# Altium schematic sheet display.SchDoc: Display
size A3; SheetNumber: 5; SheetTotal: 7
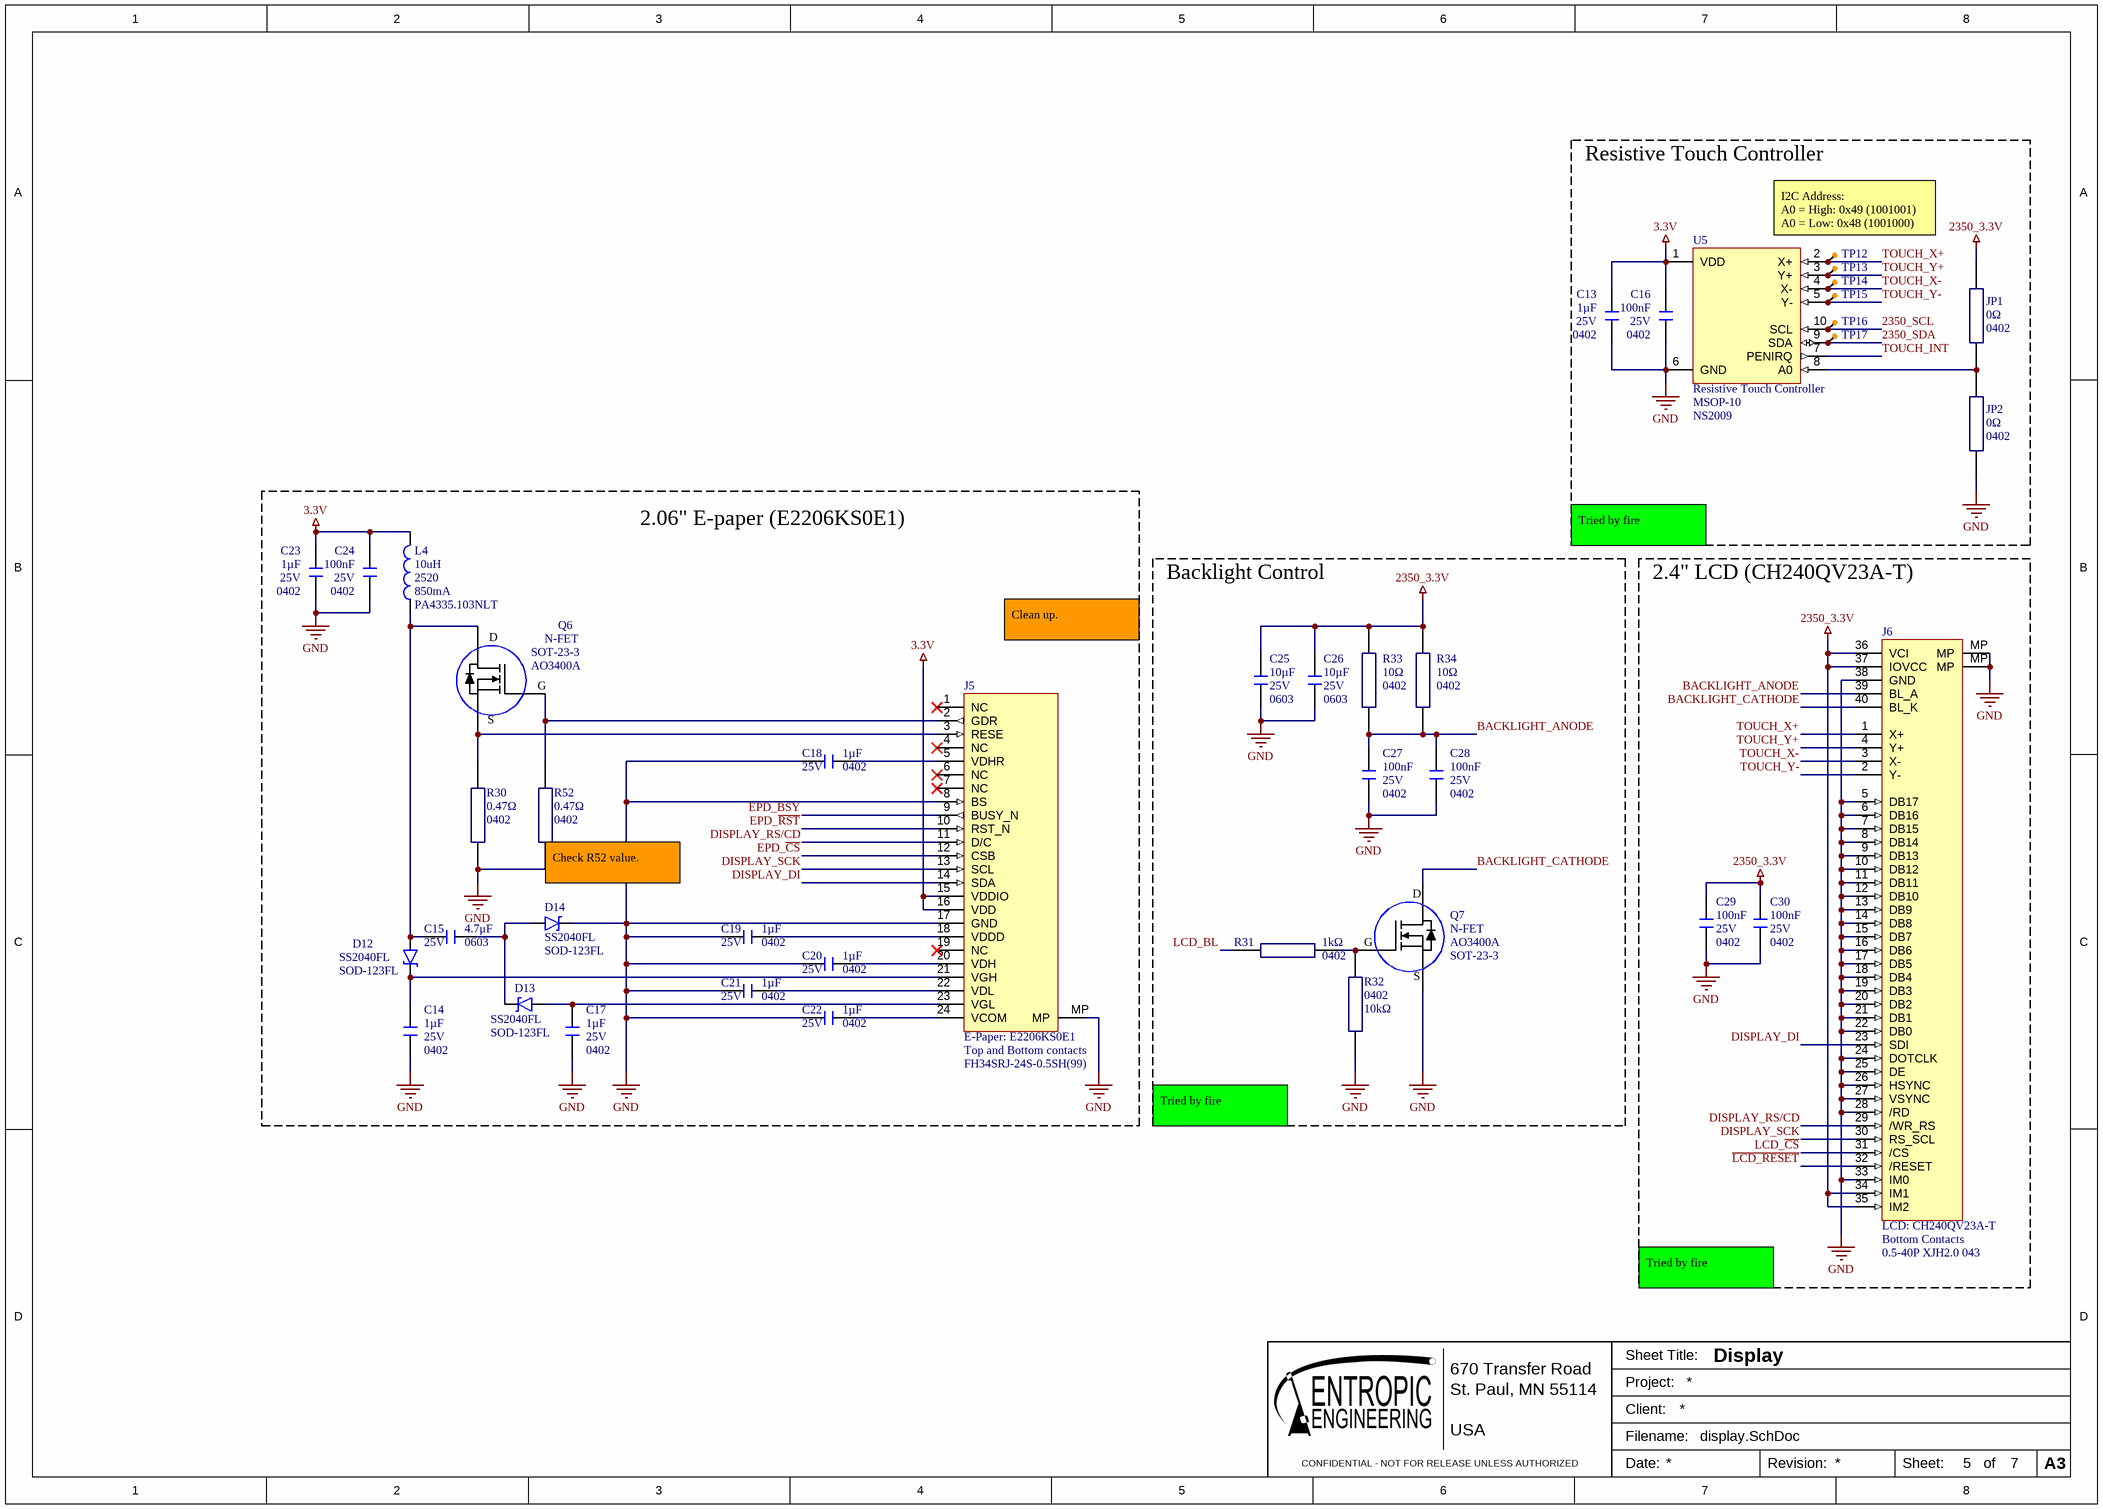
[diagram p0: display.SchDoc]

## Parts
C13  Size Code: 0402  Capacitance: 1µF  Voltage: 25V  [0402_capacitor]  (hidden comment: GRM155R61E105KA12D)
C14  Size Code: 0402  Capacitance: 1µF  Voltage: 25V  [0402_capacitor]  (hidden comment: GRM155R61E105KA12D)
C15  value 4.7μF  Voltage Rating: 25V  Case/Package: 0603  [0603_capacitor]  (hidden comment: C1608X5R1E475K080AC)
C16  Case Code (Imperial): 0402  Voltage: 25V  Capacitance: 100nF  [0402_capacitor]  (hidden comment: GRM155R71E104KE14D)
C17  Size Code: 0402  Capacitance: 1µF  Voltage: 25V  [0402_capacitor]  (hidden comment: GRM155R61E105KA12D)
C18  Size Code: 0402  Capacitance: 1µF  Voltage: 25V  [0402_capacitor]  (hidden comment: GRM155R61E105KA12D)
C19  Size Code: 0402  Capacitance: 1µF  Voltage: 25V  [0402_capacitor]  (hidden comment: GRM155R61E105KA12D)
C20  Size Code: 0402  Capacitance: 1µF  Voltage: 25V  [0402_capacitor]  (hidden comment: GRM155R61E105KA12D)
C21  Size Code: 0402  Capacitance: 1µF  Voltage: 25V  [0402_capacitor]  (hidden comment: GRM155R61E105KA12D)
C22  Size Code: 0402  Capacitance: 1µF  Voltage: 25V  [0402_capacitor]  (hidden comment: GRM155R61E105KA12D)
C23  Size Code: 0402  Capacitance: 1µF  Voltage: 25V  [0402_capacitor]  (hidden comment: GRM155R61E105KA12D)
C24  Case Code (Imperial): 0402  Voltage: 25V  Capacitance: 100nF  [0402_capacitor]  (hidden comment: GRM155R71E104KE14D)
C25  value 10µF  Case/Package: 0603  Voltage Rating: 25V  [0603_capacitor]  (hidden comment: CL10A106MA8NRNC)
C26  value 10µF  Case/Package: 0603  Voltage Rating: 25V  [0603_capacitor]  (hidden comment: CL10A106MA8NRNC)
C27  Case Code (Imperial): 0402  Voltage: 25V  Capacitance: 100nF  [0402_capacitor]  (hidden comment: GRM155R71E104KE14D)
C28  Case Code (Imperial): 0402  Voltage: 25V  Capacitance: 100nF  [0402_capacitor]  (hidden comment: GRM155R71E104KE14D)
C29  Case Code (Imperial): 0402  Voltage: 25V  Capacitance: 100nF  [0402_capacitor]  (hidden comment: GRM155R71E104KE14D)
C30  Case Code (Imperial): 0402  Voltage: 25V  Capacitance: 100nF  [0402_capacitor]  (hidden comment: GRM155R71E104KE14D)
D12  SS2040FL  Case/Package: SOD-123FL  [SOD-123]
D13  SS2040FL  Case/Package: SOD-123FL  [SOD-123]
D14  SS2040FL  Case/Package: SOD-123FL  [SOD-123]
J5  E-Paper: E2206KS0E1  contact_side: Top and Bottom contacts  Manufacturer Part Number: FH34SRJ-24S-0.5SH(99)  [E2206KS0E1]
J6  LCD: CH240QV23A-T  contact_side: Bottom Contacts  [CH240QV23A-T]
JP1  value 0Ω  Case/Package: 0402  [0402_resistor]  (hidden comment: RC0402FR-070RL)
JP2  value 0Ω  Case/Package: 0402  [0402_resistor]  (hidden comment: RC0402FR-070RL)
L4  value 10uH  Case/Package: 2520  Current Rating: 850mA  [INDC2520X12N]  (hidden comment: PA4335.103NLT)
Q6  N-FET  Case/Package: SOT-23-3  [SOT95P280X115-3N]
Q7  N-FET  Case/Package: SOT-23-3  [SOT95P280X115-3N]
R30  value 0.47Ω  Case/Package: 0402  [0402_resistor]  (hidden comment: RL0402FR-070R47L)
R31  value 1kΩ  Case/Package: 0402  [0402_resistor]  (hidden comment: RC0402JR-071KL)
R32  value 10kΩ  Case Code (Imperial): 0402  [0402_resistor]  (hidden comment: RC0402FR-0710KL)
R33  value 10Ω  Case/Package: 0402  [0402_resistor]  (hidden comment: RC0402JR-0710RL)
R34  value 10Ω  Case/Package: 0402  [0402_resistor]  (hidden comment: RC0402JR-0710RL)
R52  value 0.47Ω  Case/Package: 0402  [0402_resistor]  (hidden comment: RL0402FR-070R47L)
TP12  test_point-1  [test_point-1]  (value not drawn)  (no BOM)
TP13  test_point-1  [test_point-1]  (value not drawn)  (no BOM)
TP14  test_point-1  [test_point-1]  (value not drawn)  (no BOM)
TP15  test_point-1  [test_point-1]  (value not drawn)  (no BOM)
TP16  SENSOR_SDA  [test_point-1]  (value not drawn)  (no BOM)
TP17  SENSOR_SCL  [test_point-1]  (value not drawn)  (no BOM)
U5  Resistive Touch Controller  Case/Package: MSOP-10  [TSSOP50P490X112-10N]

## Blocks framed on the sheet
Resistive Touch Controller: C13 C16 JP1 JP2 TP12-TP17 U5
2.06" E-paper (E2206KS0E1): C14 C15 C17-C24 D12-D14 J5 L4 Q6 R30 R52
Backlight Control: C25-C28 Q7 R31-R34
2.4" LCD (CH240QV23A-T): C29 C30 J6

## Nets
3.3V: C13.2 C16.2 C23.2 C24.2 J5.15(VDDIO) J5.16(VDD) L4.1 U5.1(VDD)
2350_3.3V: C25.2 C26.2 C29.2 C30.2 J6.34(IM1) J6.35(IM2) J6.36(VCI) J6.37(IOVCC) JP1.1 R33.2 R34.2
GND: C13.1 C14.1 C16.1 C17.1 C18.1 C19.1 C20.1 C21.1 C22.1 C23.1 C24.1 C25.1 C26.1 C27.1 C28.1 C29.1 C30.1 D14.K J5.8(BS) J5.17(GND) J5.MP J6.5(DB17) J6.6(DB16) J6.7(DB15) J6.8(DB14) J6.9(DB13) J6.10(DB12) J6.11(DB11) J6.12(DB10) J6.13(DB9) J6.14(DB8) J6.15(DB7) J6.16(DB6) J6.17(DB5) J6.18(DB4) J6.19(DB3) J6.20(DB2) J6.21(DB1) J6.22(DB0) J6.24(DOTCLK) J6.25(DE) J6.26(HSYNC) J6.27(VSYNC) J6.28(/RD) J6.33(IM0) J6.38(GND) J6.MP JP2.2 Q7.2(S) R30.1 R32.2 R52.1 U5.6(GND)
2350_SCL: TP16.1 U5.10(SCL)
2350_SDA: TP17.1 U5.9(SDA)
~{LCD_RESET}: J6.32(/RESET)
BACKLIGHT_ANODE: C27.2 C28.2 J6.39(BL_A) R33.1 R34.1
BACKLIGHT_CATHODE: J6.40(BL_K) Q7.3(D)
DISPLAY_DI: J5.14(SDA) J6.23(SDI)
DISPLAY_RS/CD: J5.11(D/C) J6.29(/WR_RS)
DISPLAY_SCK: J5.13(SCL) J6.30(RS_SCL)
EPD_~{BSY}: J5.9(BUSY_N)
EPD_~{CS}: J5.12(CSB)
EPD_~{RST}: J5.10(RST_N)
LCD_BL: R31.1
LCD_~{CS}: J6.31(/CS)
TOUCH_INT: U5.7(PENIRQ)
TOUCH_X+: J6.1(X+) TP12.1 U5.2(X+)
TOUCH_X-: J6.3(X-) TP14.1 U5.4(X-)
TOUCH_Y+: J6.4(Y+) TP13.1 U5.3(Y+)
TOUCH_Y-: J6.2(Y-) TP15.1 U5.5(Y-)
NetC14_2: C14.2 D12.K J5.21(VGH)
NetC15_1: C15.1 D12.A L4.2 Q6.3(D)
NetC15_2: C15.2 D13.K D14.A
NetC17_2: C17.2 D13.A J5.23(VGL)
NetC18_2: C18.2 J5.5(VDHR)
NetC19_2: C19.2 J5.18(VDDD)
NetC20_2: C20.2 J5.20(VDH)
NetC21_2: C21.2 J5.22(VDL)
NetC22_2: C22.2 J5.24(VCOM)
NetJ5_2: J5.2(GDR) Q6.1(G) R52.2
NetJ5_3: J5.3(RESE) Q6.2(S) R30.2
NetJP1_2: JP1.2 JP2.1 U5.8(A0)
NetQ7_1: Q7.1(G) R31.2 R32.1

Not connected (* = marked no-connect by the designer): J5 1(NC)* 4(NC)* 6(NC)* 7(NC)* 19(NC)*

## Notes on the sheet
- I2C Address:
  A0 = High: 0x49 (1001001)
  A0 = Low: 0x48 (1001000)
- Tried by fire
- Clean up.
- (near R52) Check R52 value.
- 670 Transfer Road
- St. Paul, MN 55114
- Sheet Title:
- Project:
- CONFIDENTIAL - NOT FOR RELEASE UNLESS AUTHORIZED
- USA
- Client:
- Filename:
- Date:
- Revision:
- Sheet:
- of
- A3

## Library data of the parts
C13 C14 C17-C23 = GRM155R61E105KA12D: 1 µF, 25 V, X5R, 0402 Chip capacitor; Manufacturer: Murata; house_part_number: C-1uF-0402-002; Dielectric Material: Ceramic; Multilayer: Yes; Negative Tolerance: 10%; Supplier 1: Digi-Key; Supplier Part Number 1: 490-10017-1-ND; RoHS: Yes; Category: Ceramic Capacitors; Stock 1: 145965; Pricing 1: 1=0.11000, 10=0.08300, 50=0.04560, 100=0.03720, 500=0.02656, 1000=0.02087, 2500=0.01898, 5000=0.01746 (USD); Mount: Surface Mount; Number of Pins: 2; Package Shape: Rectangular; Terminal Finish: Nickel; Min Operating Temperature: -55°C; Max Operating Temperature: 85°C; JESD-609 Code: e3; Capacitor Type: Ceramic; Package Style: SMTMeter; Packaging: Tape and Reel; Positive Tolerance: 10%; Temperature Characteristics Code: X5R; Termination: Wraparound; Length: 1mm; Width: 0.5mm; Height: 0.5mm; REACH SVHC: Yes; RoHS Compliant: Yes; ComponentLink1URL: https://datasheet.ciiva.com:443/pdfs/VipMasterIC/IC/MURE/MURE-S-A0004362469/MURE-S-A0004364524-1.pdf?src-supplier=IHS+Markit; ComponentLink1Description: https://datasheet.ciiva.com:443/pdfs/VipMasterIC/IC/MURE/MURE-S-A0004362469/MURE-S-A0004364524-1.pdf?src-supplier=IHS+Markit; ComponentLink2URL: https://datasheet.ciiva.com/7719/1666664-7719006.pdf?src-supplier=Element14; ComponentLink2Description: https://datasheet.ciiva.com/7719/1666664-7719006.pdf?src-supplier=Element14; ComponentLink3URL: https://datasheet.ciiva.com/22732/1666664-22732122.pdf?src-supplier=Element14; ComponentLink3Description: https://datasheet.ciiva.com/22732/1666664-22732122.pdf?src-supplier=Element14; Manufacturer Part Number: GRM155R61E105KA12D
C15 = C1608X5R1E475K080AC: 4.7 μF, 25 V, X7R, 0603 Chip capacitor; Manufacturer: TDK; Material: Ceramic; Tolerance: 10%; Dielectric: X5R; Manufacturer Part Number: C1608X5R1E475K080AC; RoHS: Yes; Category: Ceramic Capacitors; Stock: 1983872; Pricing: 1=0.16, 10=0.104, 50=0.0732, 100=0.0592, 500=0.04396, 1000=0.03847, 4000=0.03389, 8000=0.03225 (USD); Mounting Technology: Surface Mount; Case Code (Metric): 1608; Case Code (Imperial): 0603; Min Operating Temperature: -55°C; Max Operating Temperature: 85°C; Packaging: Tape and Reel; Package Quantity: 4000; Series: C; Construction: Flat; Length: 1.6mm; Width: 0.031inch; Height: 0.8mm; Thickness: 0.039inch; Depth: 0.8mm; RoHS Compliant: Yes; Lead Free: Lead Free; ComponentLink1URL: https://datasheet.ciiva.com/48671/mlcc-commercial-general-en-48671304.pdf?src-supplier=Avnet; ComponentLink1Description: https://datasheet.ciiva.com/48671/mlcc-commercial-general-en-48671304.pdf?src-supplier=Avnet; ComponentLink2URL: https://datasheet.ciiva.com/24216/mlcc-commercial-general-en-24216326.pdf?src-supplier=Mouser; ComponentLink2Description: https://datasheet.ciiva.com/24216/mlcc-commercial-general-en-24216326.pdf?src-supplier=Mouser; Supplier: Digikey; Supplier Part Number: 445-9050-1-ND; Weight: 7.1E-05oz; Dielectric Material: Ceramic; Voltage Rating (DC): 25V; Termination: SMD/SMT; Reach SVHC Compliant: Unknown; ComponentLink3URL: https://datasheet.ciiva.com/48587/6print-detail-pdf-phplangenpart-noc1608x5r1e475k080acimp-unit-xmhz-48587141.pdf?src-supplier=Onlinecomponents.com; ComponentLink3Description: https://datasheet.ciiva.com/48587/6print-detail-pdf-phplangenpart-noc1608x5r1e475k080acimp-unit-xmhz-48587141.pdf?src-supplier=Onlinecomponents.com
C16 C24 C27-C30 = GRM155R71E104KE14D: 100 nF, 25 V, X7R, 0402 Chip capacitor; Manufacturer: Murata; house_part_number: C-100nF-0402-002; Dielectric Material: Ceramic; Tolerance: 10%; Supplier 1: Digi-Key; Supplier Part Number 1: 490-10698-1-ND; RoHS: Yes; Category: Ceramic Capacitors; Pricing 1: 1=0.10000, 10=0.02700, 50=0.01460, 100=0.01190, 500=0.00848, 1000=0.00666, 2500=0.00605, 5000=0.00557 (USD); Mount: Surface Mount; Case/Package: 0402; Case Code (Metric): 1005; Weight: 0.000212oz; Min Operating Temperature: -55°C; Max Operating Temperature: 125°C; Packaging: Tape and Reel; Voltage Rating: 25V; Dielectric: X7R; Termination: SMD/SMT; Resistor Type: Ceramic; Voltage Rating (DC): 25V; Package Quantity: 10000; Length: 1mm; Width: 0.02inch; Height: 0.5mm; Thickness: 0.022inch; Depth: 0.5mm; REACH SVHC: Unknown; Lead Free: Lead Free; RoHS Compliant: Yes; ComponentLink1URL: http://www.farnell.com/datasheets/1872206.pdf?src-supplier=Farnell; ComponentLink1Description: http://www.farnell.com/datasheets/1872206.pdf?src-supplier=Farnell; ComponentLink2URL: http://components.arrow.com/part/dataview/0323_06361249?src-supplier=Arrow+Europe; ComponentLink2Description: http://components.arrow.com/part/dataview/0323_06361249?src-supplier=Arrow+Europe; ComponentLink3URL: http://uk.rs-online.com/webdocs/144c/0900766b8144c113.pdf?src-supplier=RSComponents; ComponentLink3Description: http://uk.rs-online.com/webdocs/144c/0900766b8144c113.pdf?src-supplier=RSComponents; ComponentLink4URL: http://www.farnell.com/datasheets/2048008.pdf?src-supplier=Farnell; ComponentLink4Description: http://www.farnell.com/datasheets/2048008.pdf?src-supplier=Farnell; ComponentLink5URL: http://www.mouser.com/ds/2/281/c02e-2905.pdf?src-supplier=Mouser; ComponentLink5Description: http://www.mouser.com/ds/2/281/c02e-2905.pdf?src-supplier=Mouser; ComponentLink6URL: http://www.farnell.com/datasheets/2048008.pdf?src-supplier=Newark; ComponentLink6Description: http://www.farnell.com/datasheets/2048008.pdf?src-supplier=Newark; ComponentLink7URL: https://search.murata.co.jp/Ceramy/image/img/A01X/G101/ENG/GRM155R71E104KE14-01.pdf?src-supplier=Digi-Key; ComponentLink7Description: https://search.murata.co.jp/Ceramy/image/img/A01X/G101/ENG/GRM155R71E104KE14-01.pdf?src-supplier=Digi-Key; ComponentLink8URL: http://www.farnell.com/datasheets/2048008.pdf?src-supplier=Element14; ComponentLink8Description: http://www.farnell.com/datasheets/2048008.pdf?src-supplier=Element14; ComponentLink9URL: http://psearch.en.murata.com/capacitor/product/GRM155R71E104KE14%23.pdf?src-supplier=Avnet; ComponentLink9Description: http://psearch.en.murata.com/capacitor/product/GRM155R71E104KE14%23.pdf?src-supplier=Avnet; Manufacturer Part Number: GRM155R71E104KE14D
C25 C26 = CL10A106MA8NRNC: 10 µF, 25 V, X5R, 0603 Chip capacitor; Manufacturer: Samsung; house_part_number: C-10uF-0603-002; Tolerance: 20%; Material: 4241ConductorMaterial; RoHS: Yes; Category: Ceramic Capacitors; Case Code (Metric): 1608; Min Operating Temperature: -55°C; Max Operating Temperature: 85°C; Packaging: Cut Tape; RoHS Compliant: Yes; ComponentLink1URL: https://datasheet.ciiva.com/25766/cl10a106ma8nrnc-25766562.pdf?src-supplier=Digikey; ComponentLink1Description: https://datasheet.ciiva.com/25766/cl10a106ma8nrnc-25766562.pdf?src-supplier=Digikey; Manufacturer Part Number: CL10A106MA8NRNC; Case Code (Imperial): 0603; Stock: 632000; Pricing: 4000=0.0511, 8000=0.046, 12000=0.0434, 28000=0.0413, 100000=0.0356 (USD); Mounting Technology: Surface Mount; Series: CL; Height: 900um; Lead Free: Lead Free; Supplier Part Number 1: CL10A106MA8NRNC; Supplier 1: Arrow Electronics
D12-D14 = SS2040FL_R1_00001: Schottky-diode 2A 40V SOD123FL; Manufacturer: Pan Jit; Max Reverse Current: 500uA; Peak Non-Repetitive Surge Current: 50A; Supplier: Mouser; Supplier Part Number: 241-SS2040FLR100001; RoHS: Yes; Category: Rectifier Diodes; Stock: 196343; Pricing: 1=0.19, 10=0.117, 50=0.117, 100=0.061, 1000=0.06, 10000=0.059 (USD); Mounting Technology: Surface Mount; Pins: 2; Min Operating Temperature: -50°C; Max Operating Temperature: 125°C; Max Repetitive Reverse Voltage (Vrrm): 40V; RoHS Compliant: Yes; ComponentLink1URL: http://www.panjit.com/upload/product/5/SS2020FL_SERIES.pdf?src-supplier=Avnet; ComponentLink1Description: http://www.panjit.com/upload/product/5/SS2020FL_SERIES.pdf?src-supplier=Avnet; Manufacturer Part Number: SS2040FL_R1_00001
J5 = FH34SRJ-24S-0.5SH: 24-Pin FPC Connector, 0.5mm pitch for E2206KS0E1 E-Paper display; Manufacturer: Hirose; Actuator Material: Nylon,Polyamide; Actuator Color: Black; Number of Positions: 24; Voltage Rating: 50V; Mating Cycles: 20; Supplier: Future Electronics; Supplier Part Number: 2094306; RoHS: Yes; Category: FFC / FPC; Stock: 500; Pricing: 500=1.61, 1000=1.59, 1500=1.56 (USD); Mounting Technology: Surface Mount; Pins: 24; Contact Material: Bronze; Contact Plating: Gold; Housing Material: Polymer; Housing Color: Grey; Min Operating Temperature: -55°C; Max Operating Temperature: 85°C; Packaging: Cut Tape; Termination: Solder; Series: FH34SRJ; Flammability Rating: UL94 V-0; RoHS Compliant: Yes; ComponentLink1URL: https://www.hirose.com/product/en/download_file/key_name/FH34SRJ/category/Catalog/doc_file_id/31646/?file_category_id=4&item_id=27&is_series=1&src-supplier=Digikey; ComponentLink1Description: https://www.hirose.com/product/en/download_file/key_name/FH34SRJ/category/Catalog/doc_file_id/31646/?file_category_id=4&item_id=27&is_series=1&src-supplier=Digikey; Supplier 1: Digikey; Supplier Part Number 1: H124725CT-ND
J6 = 0.5-40P XJH2.0 043: 40-Pin, 0.5 mm pitch, bottom contact, flat flex connector for LCD CH240QV23A-T; Supplier 1: LCSC; Supplier Part Number 1: C5373441; LCD Part Number: CH240QV23A-T; Manufacturer Part Number: 0.5-40P XJH2.0 043; house_part_number: 0.5-40P XJH2.0 043
JP1 JP2 = RC0402FR-070RL: 0 Ω, 0402 Chip resistor (jumper); Manufacturer: Yageo; house_part_number: R-0-0402-1%-001; Voltage Rating: 50V; Tolerance: 1%; Power Rating: 62.5mW; Temperature Coefficient: 200ppm/°C; Max Power Dissipation: 63mW; Manufacturer Part Number: RC0402FR-070RL; RoHS: Yes; Category: Chip SMD Resistors; Stock: 580000; Pricing: 10000=0.00093 (USD); Mounting Technology: Surface Mount; Contact Plating: Tin,Matte; Case Code (Imperial): 0402; Case Code (Metric): 1005; Min Operating Temperature: -55°C; Max Operating Temperature: 155°C; Packaging: Tape and Reel; Termination: SMD/SMT; Features: Moisture Resistant; Series: RC; Number of Terminations: 2; Length: 1mm; Width: 0.5mm; Height: 0.35mm; RoHS Compliant: Yes; Lead Free: 5697LeadFree; Supplier 1: Avnet; Supplier Part Number 1: RC0402FR-070RL
L4 = PA4335.103NLT: Drum Core Shielded Power Inductor Wirewound Ferrite 10uH 20% 1MHz 0.85A SMD T/R; Manufacturer: Pulse; Saturation Current: 1.1A; Self Resonant Frequency: 14MHz; DC Resistance (DCR): 480mR; RoHS: Yes; Category: Fixed Inductors; Core Material: Ferrite; Min Operating Temperature: -40°C; Max Operating Temperature: 125°C; Tolerance: 20%; Shielding: Shielded; Packaging: Cut Tape; Test Frequency: 1MHz; Series: PA4335; Length: 0.106inch; Width: 0.087inch; Height - Seated (Max): 0.047inch; RoHS Compliant: Yes; ComponentLink1URL: https://datasheet.octopart.com/PA4335.103NLT-Pulse-datasheet-151940520.pdf?src-supplier=Master+Electronics; ComponentLink1Description: https://datasheet.octopart.com/PA4335.103NLT-Pulse-datasheet-151940520.pdf?src-supplier=Master+Electronics; ComponentLink2URL: https://datasheet.octopart.com/PA4335.103NLT-Pulse-datasheet-137333241.pdf?src-supplier=Sager+Electronics; ComponentLink2Description: https://datasheet.octopart.com/PA4335.103NLT-Pulse-datasheet-137333241.pdf?src-supplier=Sager+Electronics; Manufacturer Part Number: PA4335.103NLT; Supplier: Digikey; Supplier Part Number: 553-3314-1-ND; Stock: 13968; Pricing: 1=0.36, 10=0.309, 25=0.2832, 50=0.2572, 100=0.229, 250=0.21612, 500=0.18526, 1000=0.16467 (USD); Mounting Technology: Surface Mount
Q6 Q7 = AO3400A: N-FET, 30V, 5.7A, SOT-23-3; Manufacturer: Alpha & Omega Semiconductor; Rds On Max: 26.5mR; Input Capacitance: 630pF; Max Power Dissipation: 1.4W; Drain to Source Resistance: 18mR; Number of Channels: 1NUMBER; Threshold Voltage: 650mV; Turn-Off Delay Time: 25ns; Turn-On Delay Time: 3ns; Supplier: Arrow Electronics; Supplier Part Number 1: AO3400A; RoHS: Yes; Category: MOSFETs; Stock: 141000; Pricing: 3000=0.0899, 6000=0.0869, 9000=0.0763, 30000=0.0746, 75000=0.0627 (USD); Mounting Technology: Surface Mount; Min Operating Temperature: -55°C; Max Operating Temperature: 150°C; Packaging: Cut Tape; Drain to Source Voltage (Vdss): 30V; Continuous Drain Current (ID): 5.7A; Series: -; Drain to Source Breakdown Voltage: 30V; Height: 1.25mm; Lead Free: Lead Free; RoHS Compliant: Yes; ComponentLink1URL: https://datasheet.ciiva.com/940/ao3400a-940739.pdf?src-supplier=Digikey; ComponentLink1Description: https://datasheet.ciiva.com/940/ao3400a-940739.pdf?src-supplier=Digikey; ComponentLink2URL: https://datasheet.ciiva.com/26906/getdatasheetpartid-64438-26906526.pdf?src-supplier=Verical; ComponentLink2Description: https://datasheet.ciiva.com/26906/getdatasheetpartid-64438-26906526.pdf?src-supplier=Verical; ComponentLink3URL: https://datasheet.ciiva.com/940/ao3400a-940740.pdf?src-supplier=Digikey; ComponentLink3Description: https://datasheet.ciiva.com/940/ao3400a-940740.pdf?src-supplier=Digikey; ComponentLink4URL: https://datasheet.ciiva.com/940/ao3400a-940741.pdf?src-supplier=Digikey; ComponentLink4Description: https://datasheet.ciiva.com/940/ao3400a-940741.pdf?src-supplier=Digikey; house_part_number: AO3400A; Manufacturer Part Number: AO3400A
R30 R52 = RL0402FR-070R47L: 0.47Ω, 1% 0402 Chip resistor; Manufacturer: Yageo; Voltage Rating (DC): 100V; Power Rating: 63mW; Temperature Coefficient: 800ppm/°C; Supplier: Future Electronics; Supplier Part Number: 1074735; Manufacturer Part Number: RL0402FR-070R47L; RoHS: Yes; Category: Chip SMD Resistors; Stock: 30000; Pricing: 10000=0.0251, 20000=0.0247, 30000=0.0245, 50000=0.0243, 100000=0.0237 (USD); Pins: 2; Case Code (Imperial): 0402; Case Code (Metric): 1005; Weight: 2.3E-05oz; Min Operating Temperature: -55°C; Max Operating Temperature: 125°C; Tolerance: 1%; Voltage Rating: 100V; Packaging: Cut Tape; Termination: SMD/SMT; Resistor Type: Thick Film; Package Quantity: 10000; Features: Moisture Resistant,Automotive AEC-Q200; Series: RL; Max Power Dissipation: 63mW; Number of Terminations: 2; Technology: THICK FILM; Resistance Tolerance: 1%; Length: 1mm; Width: 0.5mm; Height: 0.35mm; Ratings: AEC-Q200; Reach SVHC Compliant: No; Lead Free: Lead Free; RoHS Compliant: Yes; ComponentLink1URL: https://datasheet.ciiva.com/7850/486242-7850272.pdf?src-supplier=Element14; ComponentLink1Description: https://datasheet.ciiva.com/7850/486242-7850272.pdf?src-supplier=Element14; ComponentLink2URL: https://datasheet.ciiva.com/15328/pyu-rl-521-rohs-l-5-15328970.pdf?src-supplier=Mouser; ComponentLink2Description: https://datasheet.ciiva.com/15328/pyu-rl-521-rohs-l-5-15328970.pdf?src-supplier=Mouser
R31 = RC0402JR-071KL: 1 kΩ, 0402 Chip resistor; Manufacturer: Yageo; house_part_number: R-1k-0402-1%-001; Tolerance: 5%; Temperature Coefficient: 100ppm/°C; Voltage Rating: 50V; Power Rating: 62.5mW; Max Power Dissipation: 63mW; Manufacturer Part Number: RC0402JR-071KL; RoHS: Yes; Category: Chip SMD Resistors; Min Operating Temperature: -55°C; Max Operating Temperature: 155°C; Resistor Type: Thick Film; Packaging: Cut Tape; Termination: SMD/SMT; RoHS Compliant: Yes; ComponentLink1URL: https://datasheet.ciiva.com/7983/1018594-7983558.pdf?src-supplier=Element14; ComponentLink1Description: https://datasheet.ciiva.com/7983/1018594-7983558.pdf?src-supplier=Element14; ComponentLink2URL: https://datasheet.ciiva.com/2452/pyu-r-int-thick-7-2452756.pdf?src-supplier=Digikey; ComponentLink2Description: https://datasheet.ciiva.com/2452/pyu-r-int-thick-7-2452756.pdf?src-supplier=Digikey; ComponentLink3URL: https://datasheet.ciiva.com/2452/pyu-r-int-thick-7-2452757.pdf?src-supplier=Digikey; ComponentLink3Description: https://datasheet.ciiva.com/2452/pyu-r-int-thick-7-2452757.pdf?src-supplier=Digikey; ComponentLink4URL: https://datasheet.ciiva.com/2452/pyu-r-int-thick-7-2452755.pdf?src-supplier=Digikey; ComponentLink4Description: https://datasheet.ciiva.com/2452/pyu-r-int-thick-7-2452755.pdf?src-supplier=Digikey; ComponentLink5URL: https://datasheet.ciiva.com/7850/1018594-7850170.pdf?src-supplier=Element14; ComponentLink5Description: https://datasheet.ciiva.com/7850/1018594-7850170.pdf?src-supplier=Element14; Stock: 15490862; Pricing: 1=0.1, 10=0.018, 50=0.0102, 100=0.0083, 500=0.00528, 1000=0.00444, 5000=0.00307 (USD); Case Code (Imperial): 0402; Case Code (Metric): 1005; Series: RC; Voltage Rating (AC): 50V; Package Quantity: 1; Number of Terminations: 2; Features: Moisture Resistant; Resistance Tolerance: 5%; Length: 0.039inch; Width: 0.02inch; Height: 0.016inch; Reach SVHC Compliant: No; Lead Free: 5697LeadFree; ComponentLink6URL: https://datasheet.ciiva.com/7850/1018594-7850171.pdf?src-supplier=Element14; ComponentLink6Description: https://datasheet.ciiva.com/7850/1018594-7850171.pdf?src-supplier=Element14; ComponentLink7URL: https://datasheet.ciiva.com/17081/pyu-rc0402-51-rohs-l-6-r-17081438.pdf?src-supplier=Future+Electronics; ComponentLink7Description: https://datasheet.ciiva.com/17081/pyu-rc0402-51-rohs-l-6-r-17081438.pdf?src-supplier=Future+Electronics; Supplier 1: Digikey; Supplier Part Number 1: 311-1.0KJRCT-ND
R32 = RC0402FR-0710KL: 10 kΩ, 0402 Chip resistor; Manufacturer: Yageo; house_part_number: R-10k-0402-1%-001; Tolerance: 1%; Power Rating: 62.5mW; Temperature Coefficient: 100ppm/°C; Max Power Dissipation: 63mW; Voltage Rating (DC): 50V; Manufacturer Part Number: RC0402FR-0710KL; RoHS: Yes; Category: Chip SMD Resistors; Case/Package: 0402; Case Code (Metric): 1005; Min Operating Temperature: -55°C; Max Operating Temperature: 155°C; Packaging: Tape and Reel; Resistor Type: Thick Film; Number of Terminations: 2; Features: Moisture Resistant; Series: RC; Construction: Rectangular; Length: 1mm; Width: 0.5mm; Depth: 0.5mm; Military Standard: Not; Lead Free: 5697LeadFree; RoHS Compliant: Yes; ComponentLink1URL: https://datasheet.ciiva.com/12667/pyu-rc0402-51-rohs-l-6-r-12667067.pdf?src-supplier=Mouser; ComponentLink1Description: https://datasheet.ciiva.com/12667/pyu-rc0402-51-rohs-l-6-r-12667067.pdf?src-supplier=Mouser; Stock: 9380606; Pricing: 1=0.1, 10=0.015, 50=0.0088, 100=0.0073, 500=0.00488, 1000=0.00417, 5000=0.00297 (USD); Pins: 2; Termination: SMD/SMT; Voltage Rating: 50V; Resistance Tolerance: 1%; Lead Pitch: 0.2mm; Reach SVHC Compliant: Unknown; Supplier 1: Digikey; Supplier Part Number 1: 311-10.0KLRCT-ND
R33 R34 = RC0402JR-0710RL: 10 Ω, 0402 Chip resistor; Manufacturer: Yageo; house_part_number: R-10-0402-1%-001; Tolerance: 5%; Temperature Coefficient: 200ppm/°C; Working Voltage: 50V; Power Rating: 62.5mW; Max Power Dissipation: 63mW; RoHS: Yes; Category: Chip SMD Resistors; Min Operating Temperature: -55°C; Max Operating Temperature: 155°C; Resistor Type: Thick Film; Construction: Rectangular; Packaging: Tape and Reel; Technology: THICK FILM; Termination: SMD/SMT; RoHS Compliant: Yes; ComponentLink1URL: https://datasheet.ciiva.com/7983/1018594-7983543.pdf?src-supplier=Element14; ComponentLink1Description: https://datasheet.ciiva.com/7983/1018594-7983543.pdf?src-supplier=Element14; ComponentLink2URL: https://datasheet.ciiva.com/7850/1018594-7850138.pdf?src-supplier=Element14; ComponentLink2Description: https://datasheet.ciiva.com/7850/1018594-7850138.pdf?src-supplier=Element14; ComponentLink3URL: https://datasheet.ciiva.com/7850/1018594-7850139.pdf?src-supplier=Element14; ComponentLink3Description: https://datasheet.ciiva.com/7850/1018594-7850139.pdf?src-supplier=Element14; ComponentLink4URL: https://datasheet.ciiva.com/2452/pyu-r-int-thick-7-2452632.pdf?src-supplier=Digikey; ComponentLink4Description: https://datasheet.ciiva.com/2452/pyu-r-int-thick-7-2452632.pdf?src-supplier=Digikey; Manufacturer Part Number: RC0402JR-0710RL; Stock: 60000; Pricing: 10000=0.0011, 50000=0.001, 200000=0.001, 500000=0.001, 1250000=0.0009 (USD); Case Code (Imperial): 0402; Case Code (Metric): 1005; Voltage Rating: 50V; Resistance Tolerance: 5%; Package Quantity: 1; Number of Terminations: 2; Features: Moisture Resistant; Series: RC; Voltage Rating (AC): 50V; Length: 0.039inch; Width: 0.02inch; Height: 0.016inch; Depth: 0.5mm; Reach SVHC Compliant: No; Military Standard: Not; Lead Free: Lead Free; ComponentLink5URL: https://datasheet.ciiva.com/2452/pyu-r-int-thick-7-2452633.pdf?src-supplier=Digikey; ComponentLink5Description: https://datasheet.ciiva.com/2452/pyu-r-int-thick-7-2452633.pdf?src-supplier=Digikey; ComponentLink6URL: https://datasheet.ciiva.com/2452/pyu-r-int-thick-7-2452634.pdf?src-supplier=Digikey; ComponentLink6Description: https://datasheet.ciiva.com/2452/pyu-r-int-thick-7-2452634.pdf?src-supplier=Digikey; ComponentLink7URL: https://datasheet.ciiva.com/16741/pyu-rc0402-51-rohs-l-6-r-16741085.pdf?src-supplier=Future+Electronics; ComponentLink7Description: https://datasheet.ciiva.com/16741/pyu-rc0402-51-rohs-l-6-r-16741085.pdf?src-supplier=Future+Electronics; Supplier 1: Future Electronics; Supplier Part Number 1: 4524278
TP12-TP17 = test_point-1: Test point; pickable: no
U5 = NS2009: Manufacturer: NSIWAY; Supplier 1: LCSC; Manufacturer Part Number: NS2009; house_part_number: NS2009; Supplier Part Number 1: C219024